# EAGLE design Rolladen5 (EAGLE 9.5.1)
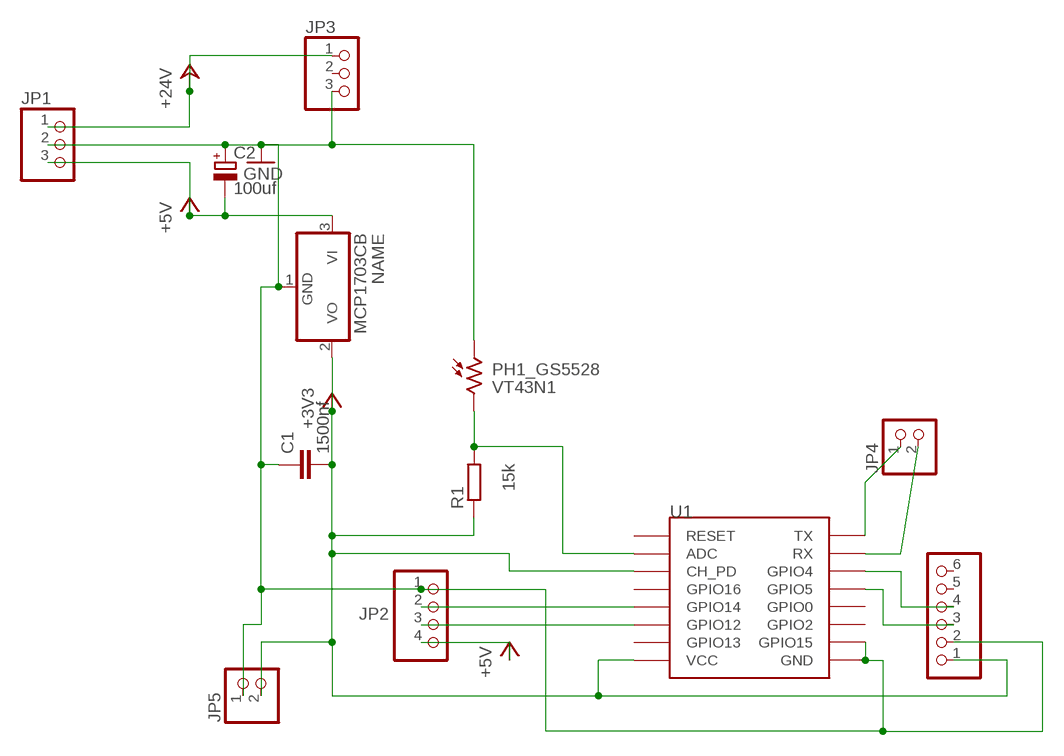
[diagram p0: schematic, sheet 1]

## Parts
C1  1500nf  C-EU025-024X044  [C025-024X044]
C2  100uf  CPOL-EUE2.5-6  [E2,5-6]
IC1_MCP1700  MCP1703CB  [SOT23]
JP1  PINHD-1X3/90  [1X03/90]
JP2  PINHD-1X4  [1X04]
JP3  PINHD-1X3  [1X03]
JP3TMP102  PINHD-1X6  [1X06]
JP4  PINHD-1X2  [1X02]
JP5  PINHD-1X2  [1X02]
PH1_GS5528  VT43N1  [VT400]
R1  15k  R-EU_0207/10  [0207/10]
U1  ESP12  [ESP12]

## Nets
+3V3: C1.2 IC1_MCP1700.2(VO) JP3TMP102.1 JP5.2 R1.1 U1.CH_PD U1.VCC
+5V: C2.- IC1_MCP1700.3(VI) JP1.3 JP2.4
+24V: JP1.1 JP3.1
GND: C1.1 C2.+ IC1_MCP1700.1(GND) JP1.2 JP2.1 JP3.3 JP3TMP102.2 JP5.1 PH1_GS5528.1 U1.GND U1.GPIO15
N$1: PH1_GS5528.2 R1.2 U1.ADC
N$2: JP3TMP102.3 U1.GPIO5
N$4: JP2.3 U1.GPIO12
N$5: JP4.1 U1.TX
N$6: JP4.2 U1.RX
N$7: JP3TMP102.4 U1.GPIO4
N$8: JP2.2 U1.GPIO14
Unconnected: JP3.2 JP3TMP102.5 JP3TMP102.6 U1.GPIO0 U1.GPIO2 U1.GPIO13 U1.GPIO16 U1.RESET

## Library data of the parts
C1 = rcl:C-EU: CAPACITOR, European symbol; SPICEPREFIX: C
C2 = rcl:CPOL-EU: POLARIZED CAPACITOR, European symbol; SPICEPREFIX: C
IC1_MCP1700 = linear:MCP1703: 250 mA, 16V, Low Quiescent Current LDO Regulator Source: http://ww1.microchip.com/downloads/en/DeviceDoc/22049b.pdf
JP1 JP3 = pinhead:PINHD-1X3: PIN HEADER
JP2 = pinhead:PINHD-1X4: PIN HEADER
JP3TMP102 = pinhead:PINHD-1X6: PIN HEADER
JP4 JP5 = pinhead:PINHD-1X2: PIN HEADER
PH1_GS5528 = photo-elements:VT43N: Photoconductive Cell VT400 Series Source: http://optoelectronics.perkinelmer.com/content/Datasheets/DTS_vt400seriesdatasheet.pdf
R1 = rcl:R-EU_: RESISTOR, European symbol; SPICEPREFIX: R
U1 = esp8266modules:ESP12: ESP8266 Wifi module 12

## Board
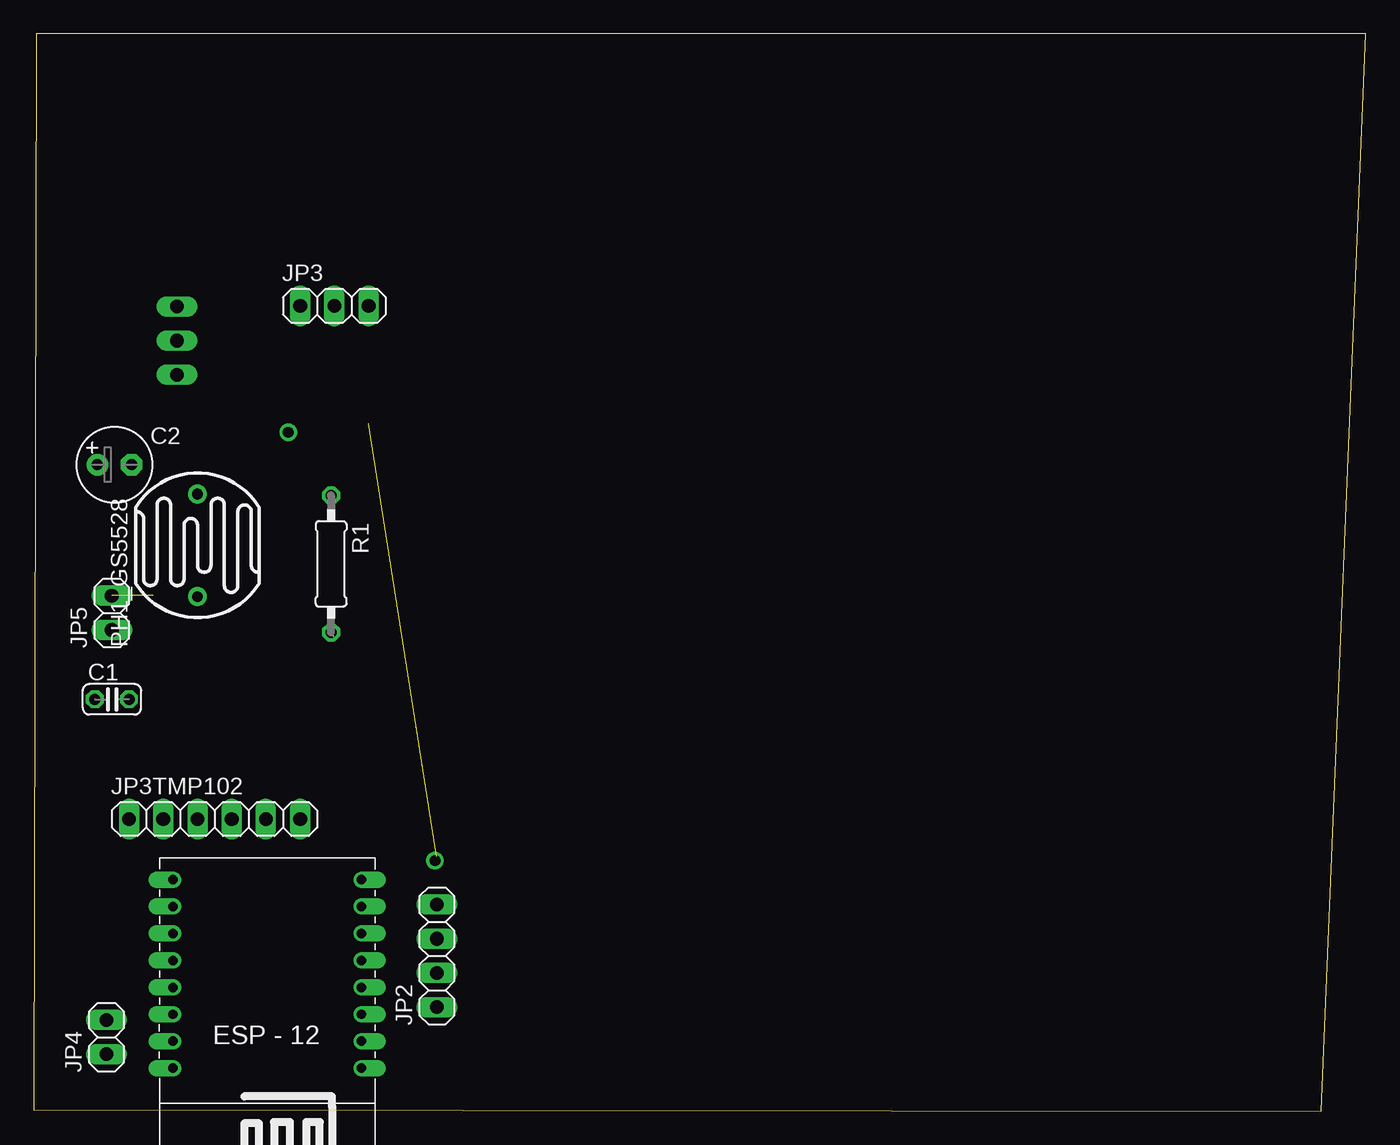
[diagram p1: board, top side]
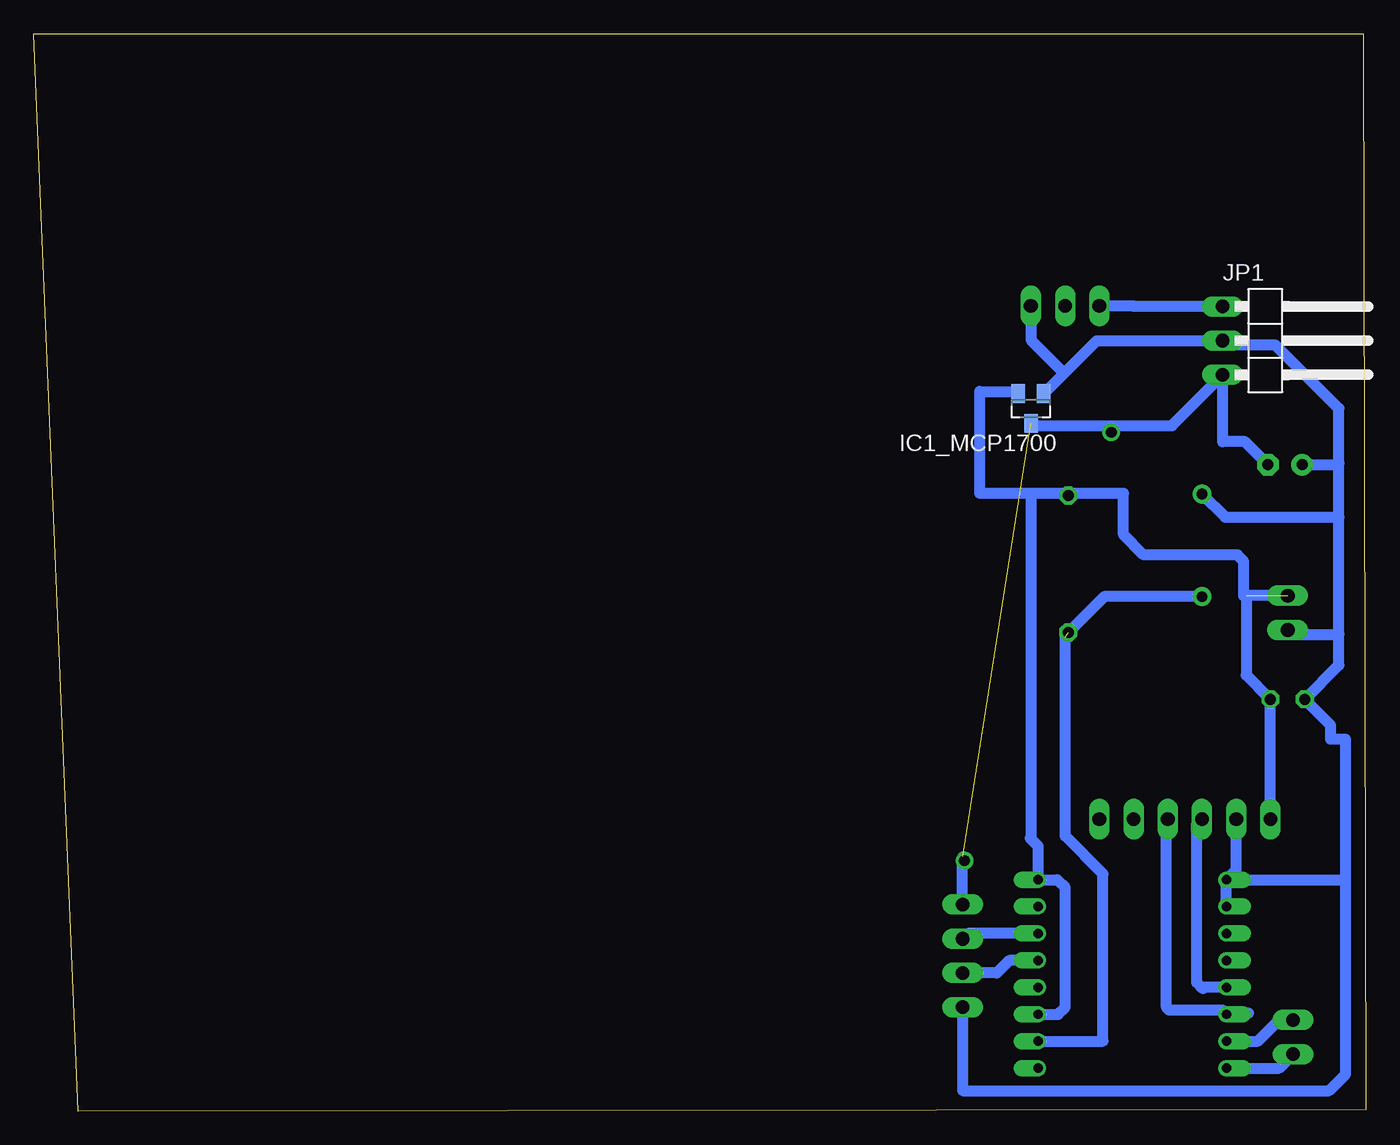
[diagram p2: board, bottom side, seen from below]

Size 98.9 x 80 mm. Coordinates in mm from the lower left corner, seen from the top.
Outline: 0,0.1 95.6,0 98.9,80 0.2,80 0,0.1
Copper layers (1*16): Top 0.035mm / dielectric 1.5mm / Bottom 0.035mm
Design rules "default": minimum track width 6mil, minimum drill 0.35mm, track to track 6mil, track to pad 6mil, pad to pad 6mil, via to via 6mil, smd to smd 6mil, copper to edge 40mil, drill to drill 6mil, minimum pad ring 10mil, minimum via ring 8mil, stop-mask expansion 4mil, vias tented up to drill 0mil, thermal gap 10mil

### Footprints (pad centres in the part's own frame; a part is rotated, then mirrored left to right if it is on the bottom)
C025-024X044 = drill 0.813 octagon: 1 -1.27,0; 2 1.27,0
E2,5-6 = drill 0.813 pad 1.6: + -1.27,0 | drill 0.813 pad 1.6 octagon: - 1.27,0
SOT23 = smd 1 x 1.4: 1 -0.95,-1.1; 2 0.95,-1.1; 3 0,1.1
1X03/90 = drill 1.016 long: 1 -2.54,-3.81; 2 0,-3.81; 3 2.54,-3.81
1X04 = drill 1.016 long: 1 -3.81,0; 2 -1.27,0; 3 1.27,0; 4 3.81,0
1X03 = drill 1.016 long: 1 -2.54,0; 2 0,0; 3 2.54,0
1X06 = drill 1.016 long: 1 -6.35,0; 2 -3.81,0; 3 -1.27,0; 4 1.27,0; 5 3.81,0; 6 6.35,0
1X02 = drill 1.016 long: 1 -1.27,0; 2 1.27,0
VT400 = drill 0.8 pad 1.4: 1 -3.81,0; 2 3.81,0
0207/10 = drill 0.813 octagon: 1 -5.08,0; 2 5.08,0
ESP12 = drill 0.7 offset: ADC -7.1,3.8; CH_PD -7.1,1.8; GND 6.9,-8.2; GPIO0 6.9,-2.2; GPIO2 6.9,-4.2; GPIO4 6.9,1.8; GPIO5 6.9,-0.2; GPIO12 -7.1,-4.2; GPIO13 -7.1,-6.2; GPIO14 -7.1,-2.2; GPIO15 6.9,-6.2; GPIO16 -7.1,-0.2; RESET -7.1,5.8; RX 6.9,3.8; TX 6.9,5.8; VCC -7.1,-8.2

### Placement (x,y rotation side)
C1  5.81,30.58 0 top
C2  6,48 0 top
IC1_MCP1700  24.86,52.17 180 bottom
JP1  6.82,57.21 270 bottom
JP2  29.94,11.53 90 top
JP3  22.32,59.79 0 top
JP3TMP102  13.43,21.69 0 top
JP4  5.4,5.5 90 top
JP5  5.8,37 90 top
PH1_GS5528  12.16,42.01 270 top
R1  22.08,40.63 270 top
U1  17.24,8.99 180 top

### Tracks (layer width: path | path; a pad name or v marks a point on that pad's centre or on a via)
+3V3  (1 unrouted)
  Bottom 0.813: 24.86,45.86 28.67,45.86 28.67,53.44 25.98,53.44 IC1_MCP1700.2 | 24.86,45.86 24.86,20.36 24.94,20.28 24.34,19.68 U1.VCC 22.9,17.19 22.32,16.61 22.32,7.72 22.85,7.19 U1.CH_PD | 8.88,38.27 8.88,32.38 C1.2 JP3TMP102.1 | JP5.2 9.08,38.27 9.08,40.84 9.54,41.3 16.5,41.3 18,42.8 18,45.86 21.93,45.86 R1.1 22.23,45.86 24.86,45.86
+5V  (1 unrouted)
  Bottom 0.813: IC1_MCP1700.3 24.69,50.9 14.4,50.9 JP1.3 10.63,49.7 8.97,49.7 C2.- | JP2.4 29.94,18.86 29.9,18.9
+24V
  Bottom 0.813: JP1.1 17.24,59.75 17.24,59.79 JP3.1
GND
  Bottom 0.813: JP2.1 29.94,1.52 2.73,1.52 1.5,2.75 1.5,17.1 | 22.49,54.69 19.97,57.21 JP1.2 10.33,56.91 6.74,56.91 2,52.17 2,48.1 | 22.49,54.69 IC1_MCP1700.1 | JP3.3 24.86,57.25 22.49,54.88 22.49,54.69 | 1.5,17.1 1.5,27.6 2.6,27.6 2.6,28.64 C1.1 2,33.12 2,35.4 | 2,35.4 2,44.1 | 2,44.1 2,48.1 | JP5.1 5.47,35.4 2,35.4 | C2.+ 2.1,48 2,48.1 | PH1_GS5528.1 10.44,44.1 2,44.1 | 10.43,15.1 U1.GPIO15 U1.GND | U1.GND 1.59,17.19 1.5,17.1 | U1.GND 9.62,17.91 JP3TMP102.2
N$1  (1 unrouted)
  Bottom 0.813: U1.ADC 19.51,5.19 19.51,17.61 22.32,20.42 22.32,35.22 | PH1_GS5528.2 19.43,38.2 R1.2
N$2
  Bottom 0.813: U1.GPIO5 12.01,9.19 12.1,9.1 12.55,9.55 12.55,21.3 JP3TMP102.3
N$3  (via drill 0.8 pad 1.3)
  other vias: 18.9,50.4
N$4
  Bottom 0.813: U1.GPIO12 29.55,13.19 JP2.3
N$5
  Bottom 0.813: U1.TX 6.44,3.19 JP4.1
N$6
  Bottom 0.813: U1.RX 8.01,5.19 6.43,6.77 JP4.2
N$7
  Bottom 0.813: 8.7,7.3 10.23,7.3 U1.GPIO4 10.65,7.5 14.6,7.5 14.8,7.7 14.8,21.59 JP3TMP102.4
N$8
  Bottom 0.813: JP2.2 27.4,10.26 26.47,11.19 U1.GPIO14
N$9  (via drill 0.8 pad 1.3)
  other vias: 29.8,18.6